# EAGLE design ADXL343 Rev B (EAGLE 9.2.0)
COMPANY: ADAFRUIT INDUSTRIES; DRAWN: KTOWN; REV: A; YEAR: 2018
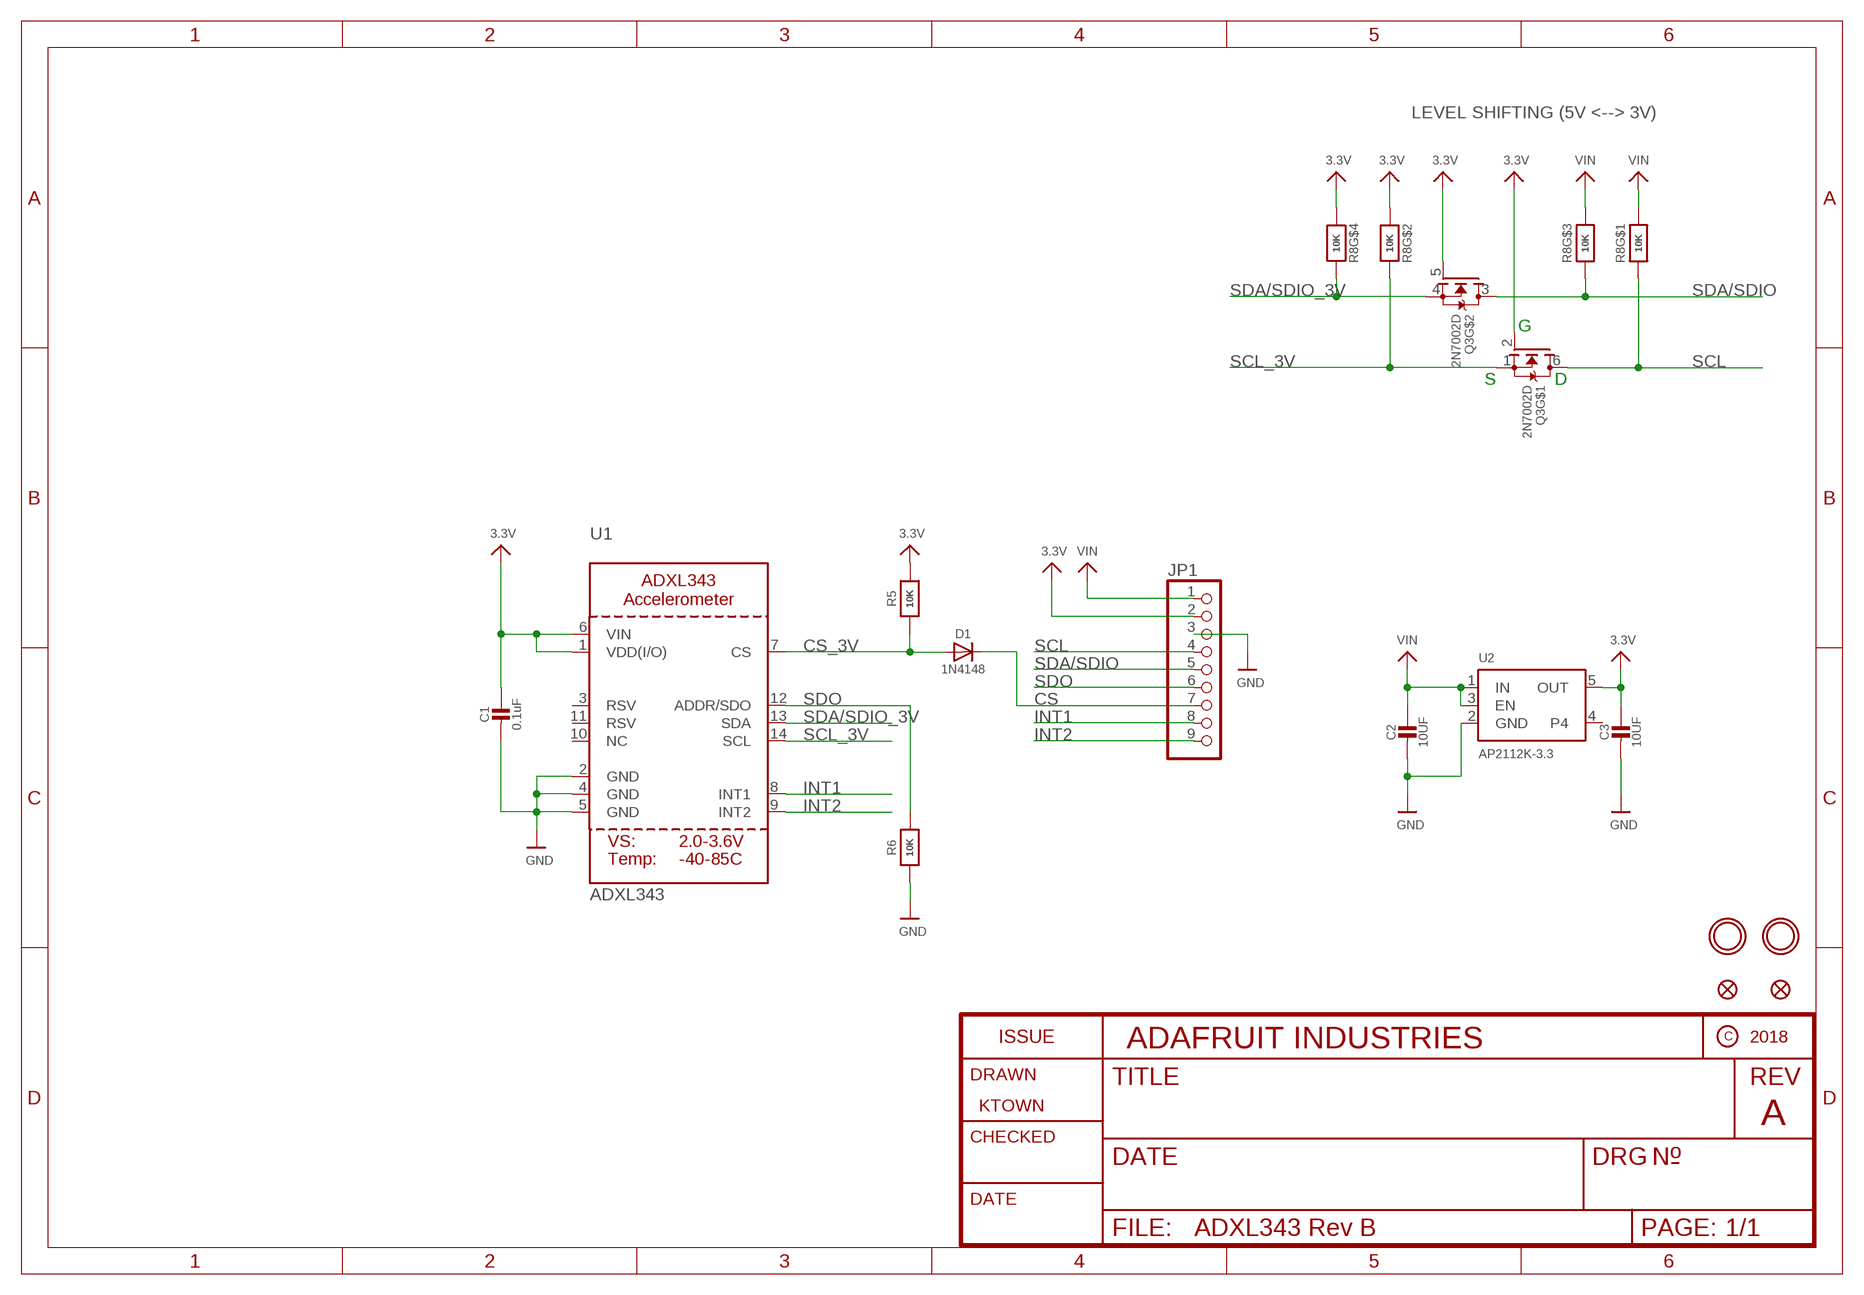
[diagram p0: schematic, sheet 1]

## Parts
C1  0.1uF  CAP_CERAMIC0603_NO  [0603-NO]
C2  10UF  CAP_CERAMIC0805-NOOUTLINE  [0805-NO]
C3  10UF  CAP_CERAMIC0805-NOOUTLINE  [0805-NO]
D1  1N4148  DIODESOD-323  [SOD-323]
JP1  HEADER-1X970MIL  [1X09_ROUND_70]
Q3  2N7002D  MOSFET-N_DUAL  [SOT363]
R5  10K  RESISTOR_0603_NOOUT  [0603-NO]
R6  10K  RESISTOR_0603_NOOUT  [0603-NO]
R8  10K  RESISTOR_4PACK  [RESPACK_4X0603]
U1  ADXL343  ACCEL_ADXL343  [LGA14]
U2  AP2112K-3.3  VREG_SOT23-5  [SOT23-5]
U$1  FIDUCIAL_1MM  [FIDUCIAL_1MM]
U$3  FIDUCIAL_1MM  [FIDUCIAL_1MM]
U$4  MOUNTINGHOLE2.5  [MOUNTINGHOLE_2.5_PLATED]
U$6  MOUNTINGHOLE2.5  [MOUNTINGHOLE_2.5_PLATED]

## Nets
3.3V: C1.1 C3.1 JP1.2 Q3.2(G) Q3.5(G) R5.2 R8.2 R8.4 U1.1(VDD(I/O)) U1.6(VIN) U2.5(OUT)
CS: D1.C JP1.7
CS_3V: D1.A R5.1 U1.7(CS)
GND: C1.2 C2.2 C3.2 JP1.3 R6.1 U1.2(GND) U1.4(GND) U1.5(GND) U2.2(GND)
INT1: JP1.8 U1.8(INT1)
INT2: JP1.9 U1.9(INT2)
SCL: JP1.4 Q3.6(D) R8.8
SCL_3V: Q3.1(S) R8.7 U1.14(SCL)
SDA/SDIO: JP1.5 Q3.3(D) R8.6
SDA/SDIO_3V: Q3.4(S) R8.5 U1.13(SDA)
SDO: JP1.6 R6.2 U1.12(ADDR/SDO)
VIN: C2.1 JP1.1 R8.1 R8.3 U2.1(IN) U2.3(EN)
Unconnected: U1.3(RSV) U1.10(NC) U1.11(RSV) U2.4

## Notes on the sheet
- LEVEL SHIFTING (5V <--> 3V)
- G
- S | D

## Library data of the parts
C1-C3 = microbuilder:CAP_CERAMIC: Ceramic Capacitors For new designs, use the packages preceded by an '_' character since they are more reliable: The following footprints should be used on most boards: _0402 - Standard footprint for regular board layouts _0603 - Standard footprint for regular board layouts _0805 - Standard footprint for regular board layouts _1206 - Standard footprint for regular board layouts For extremely tight-pitch boards where space is at a premium, the following 'micro-pitch' footprints can be used (smaller pads, no silkscreen outline, etc.): _0402MP - Micro-pitch footprint for very dense/compact boards _0603MP - Micro-pitch footprint for very dense/compact boards _0805MP - Micro-pitch footprint for very dense/compact boards _1206MP - Micro-pitch footprint for very dense/compact boards
D1 = microbuilder:DIODE: Diode SMA Model Volts Amps Type Vf Ir Digikey # Notes SSA34-E3 40V 3A Schottky 480mV @ 3A 200uA @ 40V SSA34-E3/61TGITR-ND CDBA120-G 20V 1A Schottky 500mV @ 1A 500uA @ 20V 641-1014-6-ND REEL MBRA210 10V 2A Schottky 350mV @ 2A 700uA @ 10V MBRA210LT3 SOD-123 Model Volts Amps Type Vf Ir Order # Notes BAT54T1G 30V 200mA Schottky 800mV @ 200mA 2uA @ 25V BAT54T1GOSTR-ND B0530W 30V 500mA Schottky 430mV @ 500mA 130uA @ 30V B0530W-FDICT-ND REEL MBR120 20V 1A Schottky 340mV @ 1A MBR120VLSFT1GOSCT-ND SOD-323 Model Volts Amps Type Vf Ir Order # Notes PMEG2005EJ 20V 500mA Schottky 355mV @ 500mA 568-4110-1-ND ZLLS410 10V 570mA Schottky 380mV @ 570mA ZLLS410CT-ND 1N4148WS 75V 150mA Silicon/Simple 1V 1N4148WSFSCT-ND REEL SOD-523 Model Volts Amps Type Vf Ir Order # Notes BAT54XV2 30V 200mA Schottky 0.8V @ 100mA BAT54XV2CT-ND TB751S 30V 30mA Schottky RB751S-40TE61CT-ND SOT23-R/W (R = Solder Paste/Reflow Ovens, W = Hand-Soldering) Model Volts Amps Type Vf Ir Order # Notes BAT54FILM 40V 300mA Schottky 497-7162-1-ND POWERDI-5 Model Volts Amps Type Vf Ir Order # Notes PDS560 60V 5A Schottky 670mV @ 5A 150uA @ 60V PDS560DICT-ND
JP1 = microbuilder:HEADER-1X9: PIN HEADER
Q3 = microbuilder:MOSFET-N_DUAL: Dual N-Channel MOSFET SOT363 (2.0x1.25mm) 2N7002PS - 60V, 320mA [Digikey: 568-5984-1-ND]
R5 R6 = microbuilder:RESISTOR: Resistors For new designs, use the packages preceded by an '_' character since they are more reliable: The following footprints should be used on most boards: _0402 - Standard footprint for regular board layouts _0603 - Standard footprint for regular board layouts _0805 - Standard footprint for regular board layouts _1206 - Standard footprint for regular board layouts For extremely tight-pitch boards where space is at a premium, the following 'micro-pitch' footprints can be used (smaller pads, no silkscreen outline, etc.): _0402MP - Micro-pitch footprint for very dense/compact boards _0603MP - Micro-pitch footprint for very dense/compact boards _0805MP - Micro-pitch footprint for very dense/compact boards _1206MP - Micro-pitch footprint for very dense/compact boards
R8 = microbuilder:RESISTOR_4PACK: Resistor Packs (4 resistors) 4 x 0603 10K 1/16W - Digikey: YC164J-10KCT-ND
U1 = microbuilder:ACCEL_ADXL343: ADXL343 - Digital Accelerometer 2/4/8/16g
U2 = microbuilder:VREG_SOT23-5: SOT23-5 Fixed Voltage Regulators Part Current Out V Out V In V Dropout θJA (°C/W) TJ (°C) Digikey Part No. ADP121 150mA 3.3V 3.4-5.5V 0.09V @ 150mA -- -- ADP121-AUJZ33R7CT-ND ADP121 150mA 3.0V 3.1-5.5V 0.09V @ 150mA -- -- ADP121-AUJZ30R7CT-ND ADP122 300mA 3.3V 3.4-5.5V 0.085V @ 300mA -- -- ADP122AUJZ-3.3-R7CT-ND ADP1712 300mA 3.3V 3.5-5.5V 0.17V @ 300mA -- -- ADP1712AUJZ-3.3-R7TR-ND AP7311 (Low Cost) 150mA 3.3V 3.5-6V 0.15V @ 150mA -- -- AP7311-33WG-7DICT-ND LD39015M18R 150mA 1.8V 1.9V-5.5V 0.08V @ 100mA -- -- 497-6977-1-ND LP2985A-33DBVR 150mA 3.3V 3.3-16V 0.28V @ 150mA 206 150 296-18479-1-ND MCP1824T-3302E/OT 300mA 3.3V 3.5V-6V 0.2V @ 300mA -- -- MCP1824T-3302E/OTCT-ND MIC5205-2.5YM5 TR 150mA 2.5V 2.7-16V 0.165V @ 150mA -- -- 576-1257-2-ND MIC5205-3.0YM5 TR 150mA 3.0V 3.2V-16V 0.165V @ 150mA -- -- 576-1258-2-ND MIC5205-3.3YM5 TR 150mA 3.3V 3.5V-16V 0.165V @ 150mA -- -- 576-1259-2-ND TPS780330220 150mA 3.3V+2.2V 3.6-5.5V 250mV Max -- -- 296-23332-1-ND TDA3663/N1,135 100mA 3.3V 3.5-45V 0.18V @ 50mA -- -- 568-5343-1-ND Max operating temp can be calculated using θJA, TJ (max junction temperature), and power in watts. Set the "Maximum Ambient Temperature" until it reaches TJ ("Max Junction Temperature"), which is the absolute limit for safe use of the regulator: Heat Sink Temperature Calculator <http://www.daycounter.com/Calculators/Heat-Sink-Temperature-Calculator.phtml> For example, With 12V source into a 3.3V LP2985 and a 30mA load, we are dissipating (12V-3.3V) * 0.03A = 0.261W. With a θJA of 206 °C/W, a TJ of 150°C, and 261mW we can safely use the chip without a heat sink up to 75°C (=147.1°C Junction Temperature).
U$1 U$3 = microbuilder:FIDUCIAL: Fiducial Alignment Points Various fiducial points for machine vision alignment.; BOM: EXCLUDE
U$4 U$6 = microbuilder:MOUNTINGHOLE: Mounting Hole For #2 screws (0.086"/2.18mm width, 0.094"/2.4mm hole) use 2.5mm; BOM: EXCLUDE

## Board
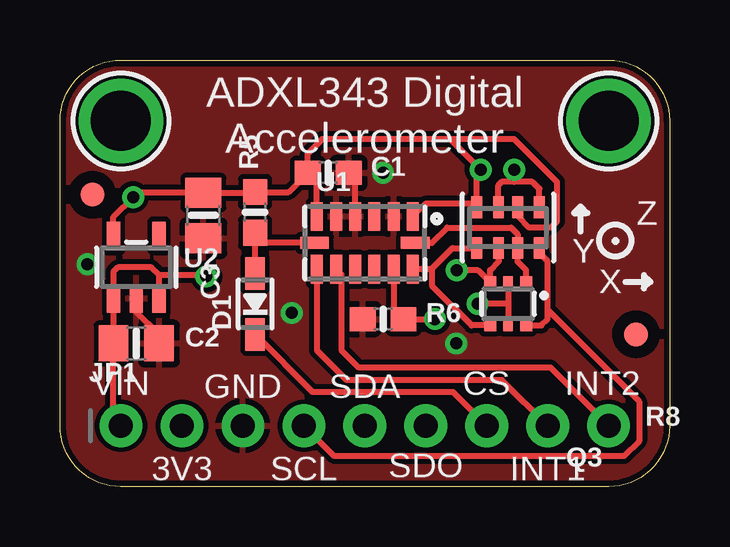
[diagram p1: board, top side]
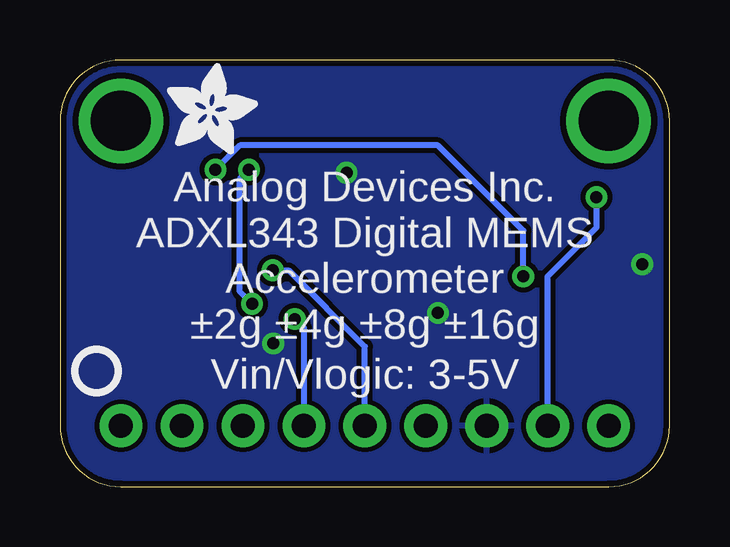
[diagram p2: board, bottom side, seen from below]

Size 25.4 x 17.78 mm. Coordinates in mm from the lower left corner, seen from the top.
Outline: 2.54,17.78 22.86,17.78 arc-90 25.4,15.24 25.4,2.54 arc-90 22.86,0 2.54,0 arc-90 0,2.54 0,15.24 arc-90 2.54,17.78
Copper layers (1*16): Top 0.035mm / dielectric 1.5mm / Bottom 0.035mm
Design rules "adafruit": minimum track width 8mil, minimum drill 15.5mil, track to track 8mil, track to pad 8mil, pad to pad 8mil, via to via 8mil, smd to smd 8mil, copper to edge 10mil, drill to drill 8mil, minimum pad ring 10mil, minimum via ring 8mil, stop-mask expansion 2mil, vias tented up to drill 20mil, thermal gap 10mil

### Footprints (pad centres in the part's own frame; a part is rotated, then mirrored left to right if it is on the bottom)
0603-NO = smd 1.075 x 1: 1 -0.85,0; 2 0.85,0
0805-NO = smd 1.24 x 1.5: 1 -0.95,0; 2 0.95,0
SOD-323 = smd 1.35 x 0.8: A 1.27,0; C -1.27,0
1X09_ROUND_70 = drill 1 pad 1.778: 1 -10.16,0; 2 -7.62,0; 3 -5.08,0; 4 -2.54,0; 5 0,0; 6 2.54,0; 7 5.08,0; 8 7.62,0; 9 10.16,0
SOT363 = smd 0.5 x 0.5: 1 -0.75,-0.9; 3 0.75,-0.9; 4 0.75,0.9; 6 -0.75,0.9 | smd 0.4 x 0.5: 2 0,-0.9; 5 0,0.9
RESPACK_4X0603 = smd 0.45 x 0.9: 1 -1.3,-0.85; 2 -0.4,-0.85; 3 0.4,-0.85; 4 1.3,-0.85; 5 1.3,0.85; 6 0.4,0.85; 7 -0.4,0.85; 8 -1.3,0.85
LGA14 = smd 0.5 x 1.2: 1 2,1.1; 2 1.2,1.1; 3 0.4,1.1; 4 -0.4,1.1; 5 -1.2,1.1; 6 -2,1.1; 8 -2,-1.1; 9 -1.2,-1.1; 10 -0.4,-1.1; 11 0.4,-1.1; 12 1.2,-1.1; 13 2,-1.1 | smd 1.2 x 0.5: 7 -2.1,0; 14 2.1,0
SOT23-5 = smd 0.55 x 1.2: 1 -0.95,-1.3; 2 0,-1.3; 3 0.95,-1.3; 4 0.95,1.3; 5 -0.95,1.3
FIDUCIAL_1MM = smd 1 x 1: 1 0,0
MOUNTINGHOLE_2.5_PLATED = drill 2.5 pad 3.2: P$1 0,0

### Placement (x,y rotation side)
C1  11.18,13.08 0 top
C2  3.17,5.97 0 top
C3  5.97,11.3 270 top
D1  8.13,7.62 90 top
JP1  12.7,2.54 0 top
Q3  18.67,7.62 180 top
R5  8.13,11.43 90 top
R6  13.46,6.99 0 top
R8  18.67,10.79 180 top
U1  12.7,10.16 0 top
U2  3.17,9.14 0 top
U$1  1.35,12.17 0 top
U$3  24,6.35 0 top
U$4  22.86,15.24 0 top
U$5  [ADAFRUIT_3.5MM]  20.95,13.84 0 bottom
U$6  2.54,15.24 0 top
U$7  [PCBFEAT-REV-040]  23.88,4.83 0 bottom

### Tracks (layer width: path | path; a pad name or v marks a point on that pad's centre or on a via)
3.3V  (via drill 0.5)
  Top 0.254: U2.5 2.23,11.24 v3.05,12.06 3.05,12.19 3.11,12.25 C3.1 8.1,12.25 R5.2 9.53,12.28 C1.1 | U1.6 10.7,12.71 C1.1 | R8.2 19.07,11.28 19.56,10.79 20.45,10.79 20.7,11.05 20.7,12.7 18.92,14.48 16.26,14.48 | R8.4 17.37,11.81 | 17.37,11.81 17.37,13.05 v17.53,13.21 16.26,14.48 | U1.1 15.25,11.81 17.37,11.81 | C1.1 10.33,13.88 10.92,14.48 16.26,14.48 | 18.67,7.62 v17.4,7.62 | Q3.2 18.67,7.62 | 18.67,7.62 Q3.5
  Bottom 0.254: JP1.2 5.08,8.76 3.05,10.79 v3.05,12.06 | v17.53,13.21 17.91,12.83 17.91,8.13 v17.4,7.62
CS
  Top 0.254: D1.C 10.54,3.94 16.38,3.94 JP1.7
CS_3V
  Top 0.254: U1.7 8.55,10.16 R5.1 D1.A
GND  (via drill 0.5)
  Top 0.254: U1.4 12.3,13.08 C1.2 | U2.2 3.17,7.3 4.12,6.35 C2.2
  other vias: 16.51,5.97 13.46,13.08 1.14,9.27 9.65,7.24
  pour Bottom: 0,17.78 25.4,17.78 25.4,0 0,0
  pour Top: 0,17.78 25.4,17.78 25.4,0 0,0
INT1
  Top 0.254: U1.8 10.7,5.68 11.94,4.45 18.41,4.45 JP1.8
INT2
  Top 0.254: U1.9 11.72,8.84 11.72,5.69 12.45,4.96 20.44,4.96 JP1.9
SCL
  Top 0.254: R8.8 19.97,9.75 20.32,9.4 20.32,7.37 | Q3.6 20.05,6.72 20.32,6.99 20.32,7.37 | JP1.4 11.43,1.27 23.5,1.27 24.13,1.91 24.13,3.56 20.32,7.37
SCL_3V
  Top 0.254: U1.14 15.49,10.16 16.13,10.79 18.8,10.79 19.07,10.52 R8.7 19.07,9.38 19.42,9.03 Q3.1
SDA/SDIO  (via drill 0.5)
  Top 0.254: R8.6 18.29,9.93 18.29,9.4 17.92,9.03 Q3.3 17.42,9.02 v16.53,9.02
  Bottom 0.254: JP1.5 12.7,5.84 15.87,9.02 v16.53,9.02
SDA/SDIO_3V
  Top 0.254: 15.47,9.06 15.49,9.06 15.49,8.38 17.16,6.72 Q3.4 | 15.47,9.06 U1.13 | R8.5 16.35,9.95 15.47,9.06
SDO  (via drill 0.5)
  Top 0.254: U1.12 13.9,7.4 R6.2 v15.62,6.99
  Bottom 0.254: v15.62,6.99 15.24,6.6 JP1.6
VIN  (via drill 0.5)
  Top 0.254: JP1.1 2.23,2.85 C2.1 U2.1 2.23,8.96 2.41,9.14 3.81,9.14 4.12,8.83 | U2.3 4.12,8.83 | R8.3 18.27,12.55 18.41,12.7 18.92,12.7 | 18.92,12.7 19.68,12.7 19.97,12.42 R8.1 | 4.12,8.83 6.03,8.83 v6.1,8.76 | v18.92,13.21 18.92,12.7
  Bottom 0.254: v6.1,8.76 6.1,10.67 9.65,14.22 17.91,14.22 v18.92,13.21

### Text on the board
tPlace: ADXL343 Digital / Accelerometer | Z | Y | X | VIN | GND | SDA | CS | INT2 | 3V3 | SCL | SDO | INT1
bPlace: Analog Devices Inc. / ADXL343 Digital MEMS / Accelerometer / ±2g ±4g ±8g ±16g | Vin/Vlogic: 3-5V